# EAGLE schematic tx (EAGLE 9.1.3)
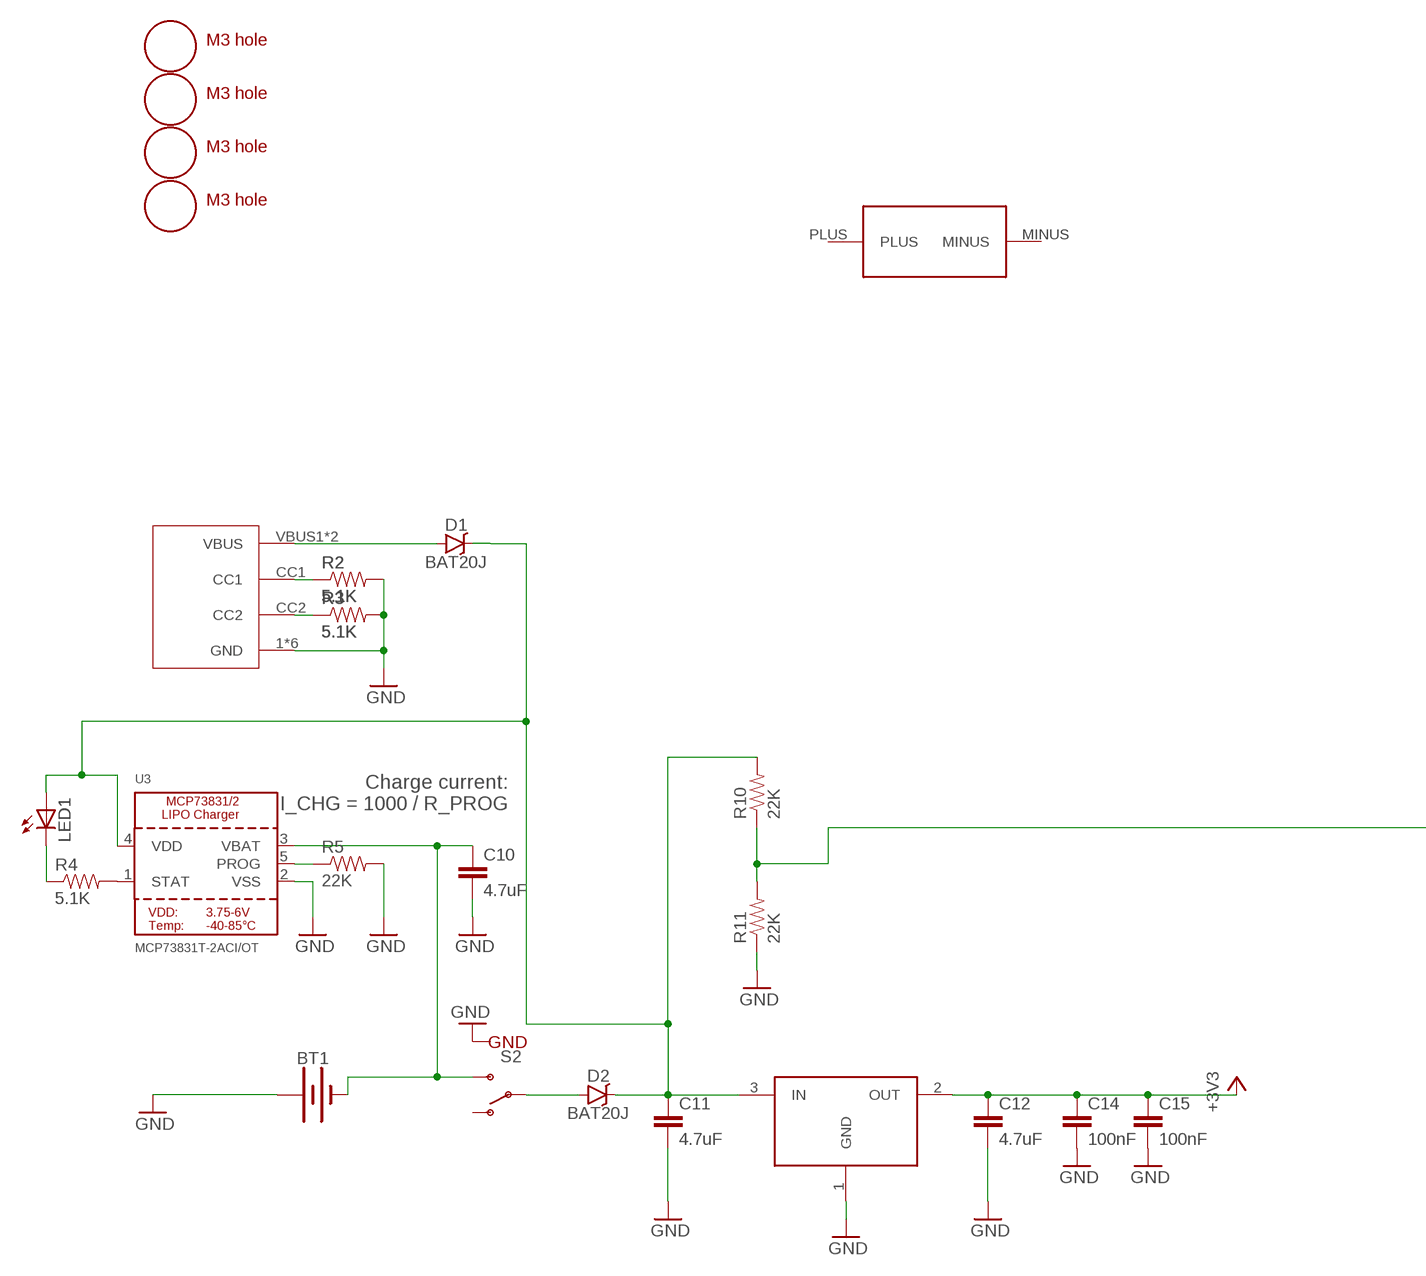
[diagram p0: schematic, sheet 1, part 1 of 2]
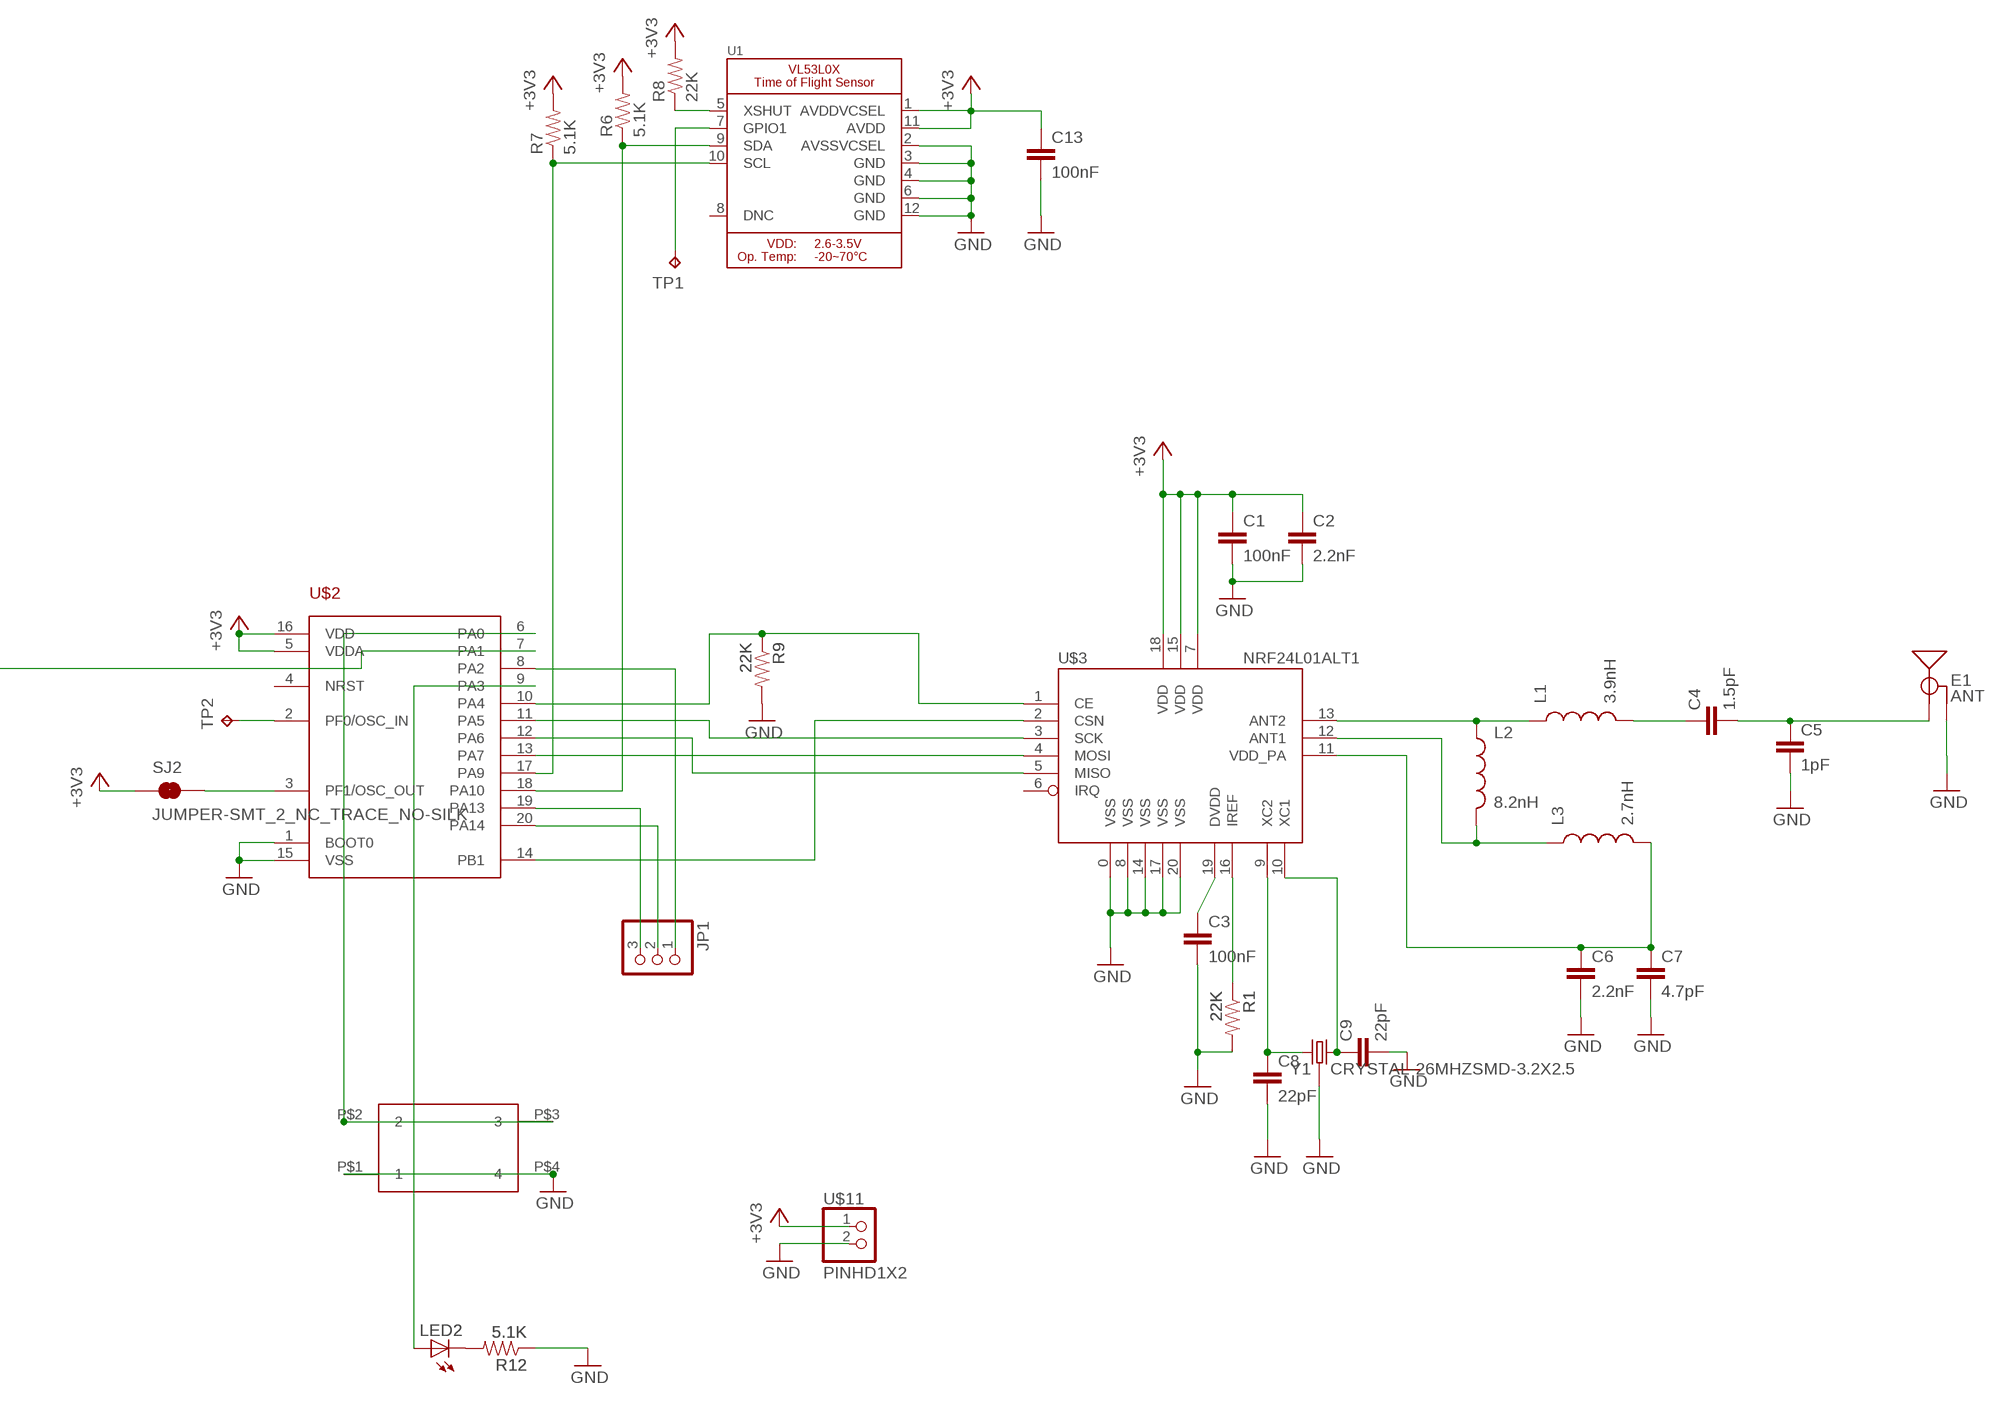
[diagram p1: schematic, sheet 1, part 2 of 2]

## Parts
BT1  TX_SPARKFUN-BATTERIES_BATTERY-24.5MM_PTH  [TX_SPARKFUN-BATTERIES_BATTCON_24.5MM_PTH]
C1  100nF  CAP0805  [0805]
C2  2.2nF  CAP0805  [0805]
C3  100nF  CAP0805  [0805]
C4  1.5pF  CAP0805  [0805]
C5  1pF  CAP0805  [0805]
C6  2.2nF  CAP0805  [0805]
C7  4.7pF  CAP0805  [0805]
C8  22pF  CAP0805  [0805]
C9  22pF  CAP0805  [0805]
C10  4.7uF  CAP0805  [0805]
C11  4.7uF  CAP0805  [0805]
C12  4.7uF  CAP0805  [0805]
C13  100nF  CAP0805  [0805]
C14  100nF  CAP0805  [0805]
C15  100nF  CAP0805  [0805]
D1  BAT20J  DIODE-SCHOTTKY-BAT20J  [SOD-323]
D2  BAT20J  DIODE-SCHOTTKY-BAT20J  [SOD-323]
E1  ANT  ANTENNA-GROUNDEDTRACE-15.2MM  [TRACE_ANTENNA_2.4GHZ_15.2MM]
JP1  PINHD-1X3CB  [1X03-CLEANBIG]
L1  3.9nH  INDUCTOR0805  [0805]
L2  8.2nH  INDUCTOR0805  [0805]
L3  2.7nH  INDUCTOR0805  [0805]
LED1  LEDCHIP-LED0805  [CHIP-LED0805]
LED2  LEDCHIP-LED0805  [CHIP-LED0805]
R1  22K  RESISTOR0805-RES  [0805]
R2  5.1K  RESISTOR0805-RES  [0805]
R3  5.1K  RESISTOR0805-RES  [0805]
R4  5.1K  RESISTOR0805-RES  [0805]
R5  22K  RESISTOR0805-RES  [0805]
R6  5.1K  RESISTOR0805-RES  [0805]
R7  5.1K  RESISTOR0805-RES  [0805]
R8  22K  RESISTOR0805-RES  [0805]
R9  22K  RESISTOR0805-RES  [0805]
R10  22K  RESISTOR0805-RES  [0805]
R11  22K  RESISTOR0805-RES  [0805]
R12  5.1K  RESISTOR0805-RES  [0805]
S2  SWITCH-SPDTTDFGDFG  [SWITCH-SPST-SMD-A]
SJ2  JUMPER-SMT_2_NC_TRACE_NO-SILK  [SMT-JUMPER_2_NC_TRACE_NO-SILK]
TP1  TPTP12R  [TP12R]
TP2  TPTP12R  [TP12R]
U1  VL53L0X  [LGA12_ST]
U3  MCP73831T-2ACI/OT  MCP73831/2  [SOT23-5]
U$1  L1_USBC_6P_DEV  [L1_USBC_6P_PAC]
U$2  STM32F030F4  [TSSOP20]
U$3  NRF24L01ALT1  [QFN20_ALT1]
U$4  AAA_SYM  [AAAWTF]
U$5  M3_MOUNTING_HOLE  [M3_MOUNTING_HOLE_PACK]
U$6  M3_MOUNTING_HOLE  [M3_MOUNTING_HOLE_PACK]
U$7  M3_MOUNTING_HOLE  [M3_MOUNTING_HOLE_PACK]
U$8  M3_MOUNTING_HOLE  [M3_MOUNTING_HOLE_PACK]
U$9  XC6206_DEV  [SOT23R_INFINEON]
U$10  324_SW324_SWITCH_FOOT_HOLE  [342_SWICH_FOOT_HOLE]
U$11  PINHD1X2  [1X02]
Y1  CRYSTAL-26MHZSMD-3.2X2.5  [CRYSTAL-SMD-3.2X2.5MM]

## Nets
+3V3: C1.1 C2.1 C12.1 C13.1 C14.1 C15.1 R6.2 R7.2 R8.2 SJ2.1 U1.1(AVDDVCSEL) U1.11(AVDD) U$2.5(VDDA) U$2.16(VDD) U$3.7(VDD) U$3.15(VDD) U$3.18(VDD) U$9.2(OUT) U$11.1
GND: BT1.2(+) C1.2 C2.2 C3.2 C5.2 C6.2 C7.2 C8.2 C9.2 C10.2 C11.2 C12.2 C13.2 C14.2 C15.2 E1.GND R1.2 R2.2 R3.2 R5.2 R9.2 R11.1 R12.1 S2.G1(GND) S2.G2(GND) S2.G3(GND) S2.G4(GND) U1.2(AVSSVCSEL) U1.3(GND) U1.4(GND) U1.6(GND) U1.12(GND) U3.2(VSS) U$1.1(GND) U$1.2(GND) U$1.3(GND) U$1.4(GND) U$1.GND1(GND) U$1.GND2(GND) U$2.1(BOOT0) U$2.15(VSS) U$3.0(VSS) U$3.8(VSS) U$3.14(VSS) U$3.17(VSS) U$3.20(VSS) U$9.1(GND) U$10.P$1 U$10.P$4 U$11.2 Y1.2 Y1.4
N$1: C3.1 U$3.19(DVDD)
N$2: R1.1 U$3.16(IREF)
N$3: L1.1 L2.1 U$3.13(ANT2)
N$4: C4.1 L1.2
N$5: C4.2 C5.1 E1.ANT(SIGNAL)
N$6: L2.2 L3.1 U$3.12(ANT1)
N$7: C8.1 U$3.9(XC2) Y1.1
N$8: C6.1 C7.1 L3.2 U$3.11(VDD_PA)
N$9: C9.1 U$3.10(XC1) Y1.3
N$10: R3.1 U$1.CC2
N$11: R2.1 U$1.CC1
N$12: LED1.C R4.1
N$13: R4.2 U3.1(STAT)
N$14: U$2.13(PA7) U$3.4(MOSI)
N$15: U$2.12(PA6) U$3.5(MISO)
N$16: U$2.11(PA5) U$3.3(SCK)
N$17: R5.1 U3.5(PROG)
N$18: R6.1 U1.9(SDA) U$2.18(PA10)
N$19: D2.A S2.2(P)
N$20: U$2.14(PB1) U$3.2(CSN)
N$21: R9.1 U$2.10(PA4) U$3.1(CE)
N$22: R7.1 U1.10(SCL) U$2.17(PA9)
N$24: R8.1 U1.5(XSHUT)
N$25: BT1.1(-) C10.1 S2.3(S) U3.3(VBAT)
N$26: D1.A U$1.VBUS1(VBUS) U$1.VBUS2(VBUS)
N$27: C11.1 D1.C D2.C LED1.A R10.2 U3.4(VDD) U$9.3(IN)
N$28: LED2.C R12.2
N$29: LED2.A U$2.9(PA3)
N$30: U$2.6(PA0) U$10.P$2 U$10.P$3
N$31: JP1.3 U$2.19(PA13)
N$32: JP1.2 U$2.20(PA14)
N$33: JP1.1 U$2.8(PA2)
N$34: SJ2.2 U$2.3(PF1/OSC_OUT)
N$35: R10.1 R11.2 U$2.7(PA1)
N$36: TP1.TP U1.7(GPIO1)
N$37: TP2.TP U$2.2(PF0/OSC_IN)
Unconnected: S2.1(O) U1.8(DNC) U$2.4(NRST) U$3.6(IRQ) U$4.MINUS U$4.PLUS

## Notes on the sheet
- Charge current:
  I_CHG = 1000 / R_PROG

## Library data of the parts
BT1 = tx:TX_SPARKFUN-BATTERIES_BATTERY: Battery - Single Cell A variety of battery chemistries, sizes, and footprints. Device List: 20MM_PTH - Coin Cell Battery Holder - 20mm (PTH) <https://www.sparkfun.com/products/783> 20MM_PTH_KIT- Coin Cell battery Holder - 20 mm (PTH) <http://www.sparkfun.com/products/783>kit version with special mask 6.8MM_PTH - Coin Cell Battery Holder - 6.8MM(SMD) <https://www.digikey.com/product-detail/en/seiko-instruments/MS621FE-FL11E/728-1057-ND/1889208?WT.srch=1&gclid=CNOQ5a6LzdQCFZS2wAodXCkE0g> 12MM_SMD - Coin Cell Battery Holder - 12mm (SMD) <https://www.sparkfun.com/products/10592> 12MM_PTH - Coin Cell Battery Holder - 12mm (PTH) <https://www.sparkfun.com/products/7948> 20MM_SMD - 20mm Coin Cell Battery Holder (SMD) (2 legs) Used on the Big Time Watch Kit <https://www.sparkfun.com/products/11734> 20MM_SMD_4LEGS - Coin Cell Battery Holder - 20mm (SMD) <https://www.sparkfun.com/products/11892> 20MM_SMD_4LEGS_OVERPASTE - Coin Cell Battery Holder - 20mm (SMD) <https://www.sparkfun.com/products/11892> (Over-paste on the legs) 24.5MM_PTH - Coin Cell Battery Holder - 24.5mm (PTH) <https://www.sparkfun.com/products/8863> 9V - 9V Battery Holder - PC Mount Used on the SparkFun SparkPunk Sound Kit <https://www.sparkfun.com/products/11177> and SparkFun SparkPunk Sequencer Kit <https://www.sparkfun.com/products/12707> 18650 - Battery Holder - 18650 (PTH) <https://www.sparkfun.com/products/13113> AA - Battery Holder - 1xAA (PTH) <https://www.sparkfun.com/products/7949> AAA - Battery Holder - 1xAAA (PTH) <https://www.sparkfun.com/products/12718> AA_KIT - Battery Holder - 1xAA (PTH) <https://www.sparkfun.com/products/7949> Special kit package - pads only have exposed copper on one side of the board. AAA_KIT - Battery Holder - 1xAAA (PTH) <https://www.sparkfun.com/products/12718> Special kit package - pads only have exposed copper on one side of the board.; SF_SKU: PRT-08863
C1-C9 C11-C15 = clock:CAP: Capacitor Standard 0603 ceramic capacitor, and 0.1" leaded capacitor.
C10 = SparkFun-Passives:CAP: Capacitor Standard 0603 ceramic capacitor, and 0.1" leaded capacitor.
D1 D2 = SparkFun-DiscreteSemi:DIODE-SCHOTTKY: Schottky diodes in SFE's production catalog BAT20J 1A 23V 0.62Vf RB751 120mA 40V 0.37Vf PMEG4005EJ 0.5A 40V 0.42Vf MBRA140 1A 40V 0.5Vf B340A 3A 40V SMA; PROD_ID: DIO-11623
E1 = SparkFun-RF:ANTENNA-GROUNDED: Antenna w/ Ground Connection 2.4GHz antennae with signal and ground terminals. TRACE_ANTENNA_2.4GHZ_15.2MM - Meander Trace antenna 15.2 x 5.7mm footprint Based on layout from TI app note AN043 <http://www.ti.com/lit/an/swra117d/swra117d.pdf>. TRACE_ANTENNA_2.4GHZ_25.7MM - Inverted F trace antenna 25.7 x 7.5 mm footprint. Based on layout from TI design note DN0007 <http://www.ti.com/lit/an/swru120b/swru120b.pdf>.
JP1 = adafruit_changed:PINHD-1X3: PIN HEADER
L1-L3 = basicBoard:INDUCTOR: Inductors Basic Inductor/Choke - 0603 and 1206. Footprints are not proven and vary greatly between part numbers. INDUCTOR POWER 3.3UH 4.0A SMD 0.197" L x 0.197" W x 0.177" H (5.00mm x 5.00mm x 4.50mm)
LED1 LED2 = joyAnalog:LED: LED OSRAM: - CHIPLED LG R971, LG N971, LY N971, LG Q971, LY Q971, LO R971, LY R971 LH N974, LH R974 LS Q976, LO Q976, LY Q976 LO Q996 - Hyper CHIPLED LW Q18S LB Q993, LB Q99A, LB R99A - SideLED LS A670, LO A670, LY A670, LG A670, LP A670 LB A673, LV A673, LT A673, LW A673 LH A674 LY A675 LS A676, LA A676, LO A676, LY A676, LW A676 LS A679, LY A679, LG A679 - Hyper Micro SIDELED® LS Y876, LA Y876, LO Y876, LY Y876 LT Y87S - SmartLED LW L88C, LW L88S LB L89C, LB L89S, LG L890 LS L89K, LO L89K, LY L89K LS L896, LA L896, LO L896, LY L896 - TOPLED LS T670, LO T670, LY T670, LG T670, LP T670 LSG T670, LSP T670, LSY T670, LOP T670, LYG T670 LG T671, LOG T671, LSG T671 LB T673, LV T673, LT T673, LW T673 LH T674 LS T676, LA T676, LO T676, LY T676, LB T676, LH T676, LSB T676, LW T676 LB T67C, LV T67C, LT T67C, LS T67K, LO T67K, LY T67K, LW E67C LS E67B, LA E67B, LO E67B, LY E67B, LB E67C, LV E67C, LT E67C LW T67C LS T679, LY T679, LG T679 LS T770, LO T770, LY T770, LG T770, LP T770 LB T773, LV T773, LT T773, LW T773 LH T774 LS E675, LA E675, LY E675, LS T675 LS T776, LA T776, LO T776, LY T776, LB T776 LHGB T686 LT T68C, LB T68C - Hyper Mini TOPLED® LB M676 - Mini TOPLED Santana® LG M470 LS M47K, LO M47K, LY M47K Source: http://www.osram.convergy.de/
R1-R3 R9 R12 = joyAnalog:RESISTOR: Resistor Basic schematic elements and footprints for 0603, 1206, and PTH resistors.
R4-R8 R10 R11 = SparkFun-Passives:RESISTOR: Resistor Basic schematic elements and footprints for 0603, 1206, and PTH resistors.
S2 = tx:SWITCH-SPDT: SPDT Switch Simple slide switch, Spark Fun Electronics SKU : COM-00102 DPDT SMT slide switch, AYZ0202, SWCH-08179
SJ2 = SparkFun-Jumpers:JUMPER-SMT_2_NC_TRACE: Normally closed trace jumper This jumper has a trace between two pads so it's normally closed (NC). Use a razor knife to open the connection. For best results follow the IPC guidelines for cutting traces: Cutout at least 0.063 mm (0.005 in). Remove all loose material to clean up the cut area. Seal the cut with an approved epoxy. Reapply solder to reclose the connection.
TP1 TP2 = testpad:TP: Test pad
U1 = Adafruit VL53L0X:VL53L0X: VL53L0X - Laser Time of Flight Sensor (2M range)
U3 = microbuilder:MCP73831/2: MCP73831/2 LIPO Charger VDD: 3.75 - 6V Temp -40 - 85°C Programmable Charge Rate: 15-500mA NOTE: STAT is a tri-state logic output on the MCP73831 and an open-drain output on the MCP73832. SOT23-5 with 4.2V output and tri-state logic on STAT = MCP73831T-2ACI/OT
U$1 = tx:L1_USBC_6P_DEV
U$2 = exixe_pogo:STM32F030F4
U$3 = nRF24L01-Chip-v13:NRF24L01: 2.4GHz Low Power Transceiver This is the very popular, low cost, very low power RF transceiver from Nordic Semiconductor. Simple SPI interface. SKU: COM-00690
U$4 = 3pos_slide_switch:AAA_SYM
U$5-U$8 = L1:M3_MOUNTING_HOLE
U$9 = 3pos_slide_switch:XC6206_DEV
U$10 = 3pos_slide_switch:324_SW
U$11 = adafruit_changed:PINHD1X2
Y1 = SparkFun-Clocks:CRYSTAL-26MHZ: 26MHz Crystal w/ Ground Pin Digikey Example <http://www.digikey.com/product-detail/en/epson/TSX-3225%2026.0000MF09Z-AC3/SER3627CT-ND/1802878> Frequency: 26MHz Frequency Stability: ±9ppm Frequency Tolerance: ±10ppm Load Capacitance: 9pF SparkFun Products: SparkFun ESP32 Thing <https://www.sparkfun.com/products/13907> SparkFun ESP8266 Thing Dev Board <https://www.sparkfun.com/products/13711>; PROD_ID: XTAL-12454